# Altium schematic sheet Debug.SchDoc
size A3; SheetNumber: 4; SheetTotal: 5
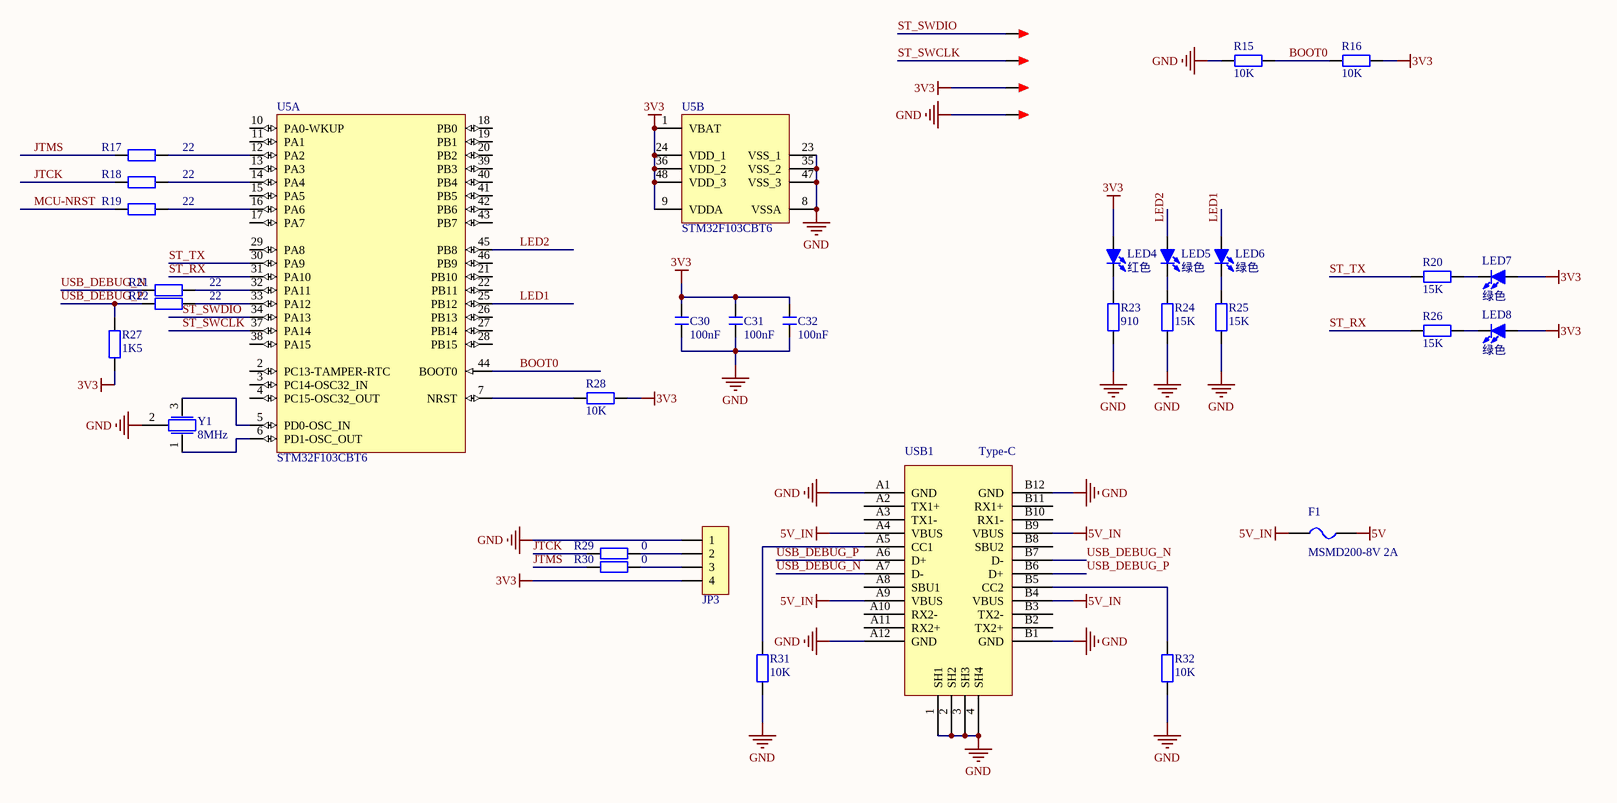
[diagram p0: Debug.SchDoc]

## Parts
C30  100nF  [C 0402_L]
C31  100nF  [C 0402_L]
C32  100nF  [C 0402_L]
F1  MSMD200-8V 2A  [FU 0603]
JP3  HDR-1X4  [HDR2.54-WI-4P]  (value not drawn)
LED4  红色  [LED]
LED5  绿色  [LED]
LED6  绿色  [LED]
LED7  绿色  [LED]
LED8  绿色  [LED]
R15  10K  [R 0402_L]
R16  10K  [R 0402_L]
R17  22  [R 0402_L]
R18  22  [R 0402_L]
R19  22  [R 0402_L]
R20  15K  [R 0402_L]
R21  22  [R 0402_L]
R22  22  [R 0402_L]
R23  910  [R 0402_L]
R24  15K  [R 0402_L]
R25  15K  [R 0402_L]
R26  15K  [R 0402_L]
R27  1K5  [R 0402_L]
R28  10K  [R 0402_L]
R29  0  [R 0402_L]
R30  0  [R 0402_L]
R31  10K  [R 0402_L]
R32  10K  [R 0402_L]
TP1  TEST  [TEST 1.2]  (value not drawn)
TP2  TEST  [TEST 1.2]  (value not drawn)
TP3  TEST  [TEST 1.2]  (value not drawn)
TP4  TEST  [TEST 1.2]  (value not drawn)
U5  STM32F103CBT6  [LQFP48-7*7]  (parts A,B of 2)
USB1  Type-C  [Type-c接口]
Y1  8MHz  [三脚晶振]

## Nets
3V3: C30.2 C31.2 C32.2 JP3.4 LED4.1(A) LED7.1(A) LED8.1(A) R16.1 R27.2 R28.1 TP3.1 U5.1(VBAT) U5.9(VDDA) U5.24(VDD_1) U5.36(VDD_2) U5.48(VDD_3)
5V: F1.2
5V_IN: F1.1 USB1.A4(VBUS) USB1.A9(VBUS) USB1.B4(VBUS) USB1.B9(VBUS)
GND: C30.1 C31.1 C32.1 JP3.1 R15.1 R23.1 R24.1 R25.1 R31.1 R32.1 TP4.1 U5.8(VSSA) U5.23(VSS_1) U5.35(VSS_2) U5.47(VSS_3) USB1.1(SH1) USB1.2(SH2) USB1.3(SH3) USB1.4(SH4) USB1.A1(GND) USB1.A12(GND) USB1.B1(GND) USB1.B12(GND) Y1.2
BOOT0: R15.2 R16.2 U5.44(BOOT0)
JTCK: R18.2 R29.1
JTMS: R17.2 R30.1
LED1: LED6.1(A) U5.25(PB12)
LED2: LED5.1(A) U5.45(PB8)
MCU-NRST: R19.2
ST_RX: R26.1 U5.31(PA10)
ST_SWCLK: TP2.1 U5.37(PA14)
ST_SWDIO: TP1.1 U5.34(PA13)
ST_TX: R20.1 U5.30(PA9)
USB_DEBUG_N: R21.2 USB1.A7(D-) USB1.B7(D-)
USB_DEBUG_P: R22.2 R27.1 USB1.A6(D+) USB1.B6(D+)
NetJP3_2: JP3.2 R29.2
NetJP3_3: JP3.3 R30.2
NetLED4_2: LED4.2(K) R23.2
NetLED5_2: LED5.2(K) R24.2
NetLED6_2: LED6.2(K) R25.2
NetLED7_2: LED7.2(K) R20.2
NetLED8_2: LED8.2(K) R26.2
NetR17_1: R17.1 U5.12(PA2)
NetR18_1: R18.1 U5.14(PA4)
NetR19_1: R19.1 U5.16(PA6)
NetR21_1: R21.1 U5.32(PA11)
NetR22_1: R22.1 U5.33(PA12)
NetR28_2: R28.2 U5.7(NRST)
NetR31_2: R31.2 USB1.A5(CC1)
NetR32_2: R32.2 USB1.B5(CC2)
NetU5_5: U5.5(PD0-OSC_IN) Y1.3
NetU5_6: U5.6(PD1-OSC_OUT) Y1.1

Not connected (* = marked no-connect by the designer): U5 2(PC13-TAMPER-RTC) 3(PC14-OSC32_IN) 4(PC15-OSC32_OUT) 10(PA0-WKUP) 11(PA1) 13(PA3) 15(PA5) 17(PA7) 18(PB0) 19(PB1) 20(PB2) 21(PB10) 22(PB11) 26(PB13) 27(PB14) 28(PB15) 29(PA8) 38(PA15) 39(PB3) 40(PB4) 41(PB5) 42(PB6) 43(PB7) 46(PB9); USB1 A2(TX1+) A3(TX1-) A8(SBU1) A10(RX2-) A11(RX2+) B2(TX2+) B3(TX2-) B8(SBU2) B10(RX1-) B11(RX1+)

## Library data of the parts
C30-C32 = C: 贴片电容; 主类型: 电容; 值/型号: 7pF/50V; 值精度: ±0.25pF; 元件封装: 0402; 具体类型: 陶瓷电容; 封装类型: 贴片; 温度漂移: C0G; 生产商: FH(风华); 生产商零件编码: 0402CG7R0C500NT; 立创编号: C1577
F1 = FU: 贴片保险丝
JP3 = Header 4: 4P接插件
LED4-LED8 = LED-SMD: C84267
R15-R19 R21 R22 R27 R28 R31 R32 = R: 贴片电阻
R20 R24-R26 = R: 贴片电阻 0402 5%; 主类型: 电阻; 值精度: ±1%; 元件封装: 0402; 封装类型: 贴片; 温度漂移: 50ppm; 生产商: 国巨; 生产商零件编码: RT0402FRE0715KL; 值/型号: 15K; 具体类型: 贴片电阻; 立创编号: C136975
R23 = R: 贴片电阻 0402 5%; 主类型: 电阻; 值/型号: 15K; 值精度: ±1%; 元件封装: 0402; 封装类型: 贴片; 温度漂移: 50ppm; 生产商: 国巨; 生产商零件编码: RT0402FRE0715KL; 具体类型: 贴片电阻; 立创编号: C136975
R29 R30 = R: 贴片电阻; 元件封装: 0402; 封装类型: 贴片
TP1-TP4 = TEST: 测试点
U5 = STM32F103CBT6: ARM Cortex-M3 32-bit MCU, 128 KB Flash, 20 KB Internal RAM, 37 I/Os, 48-pin LQFP, -40 to 85 degC, Tray
USB1 = USB-Type-C-TOP
Y1 = 晶振-3Pin: 村田贴片